# Altium schematic sheet Isolators.SchDoc
size A4; SheetNumber: 4; SheetTotal: 5
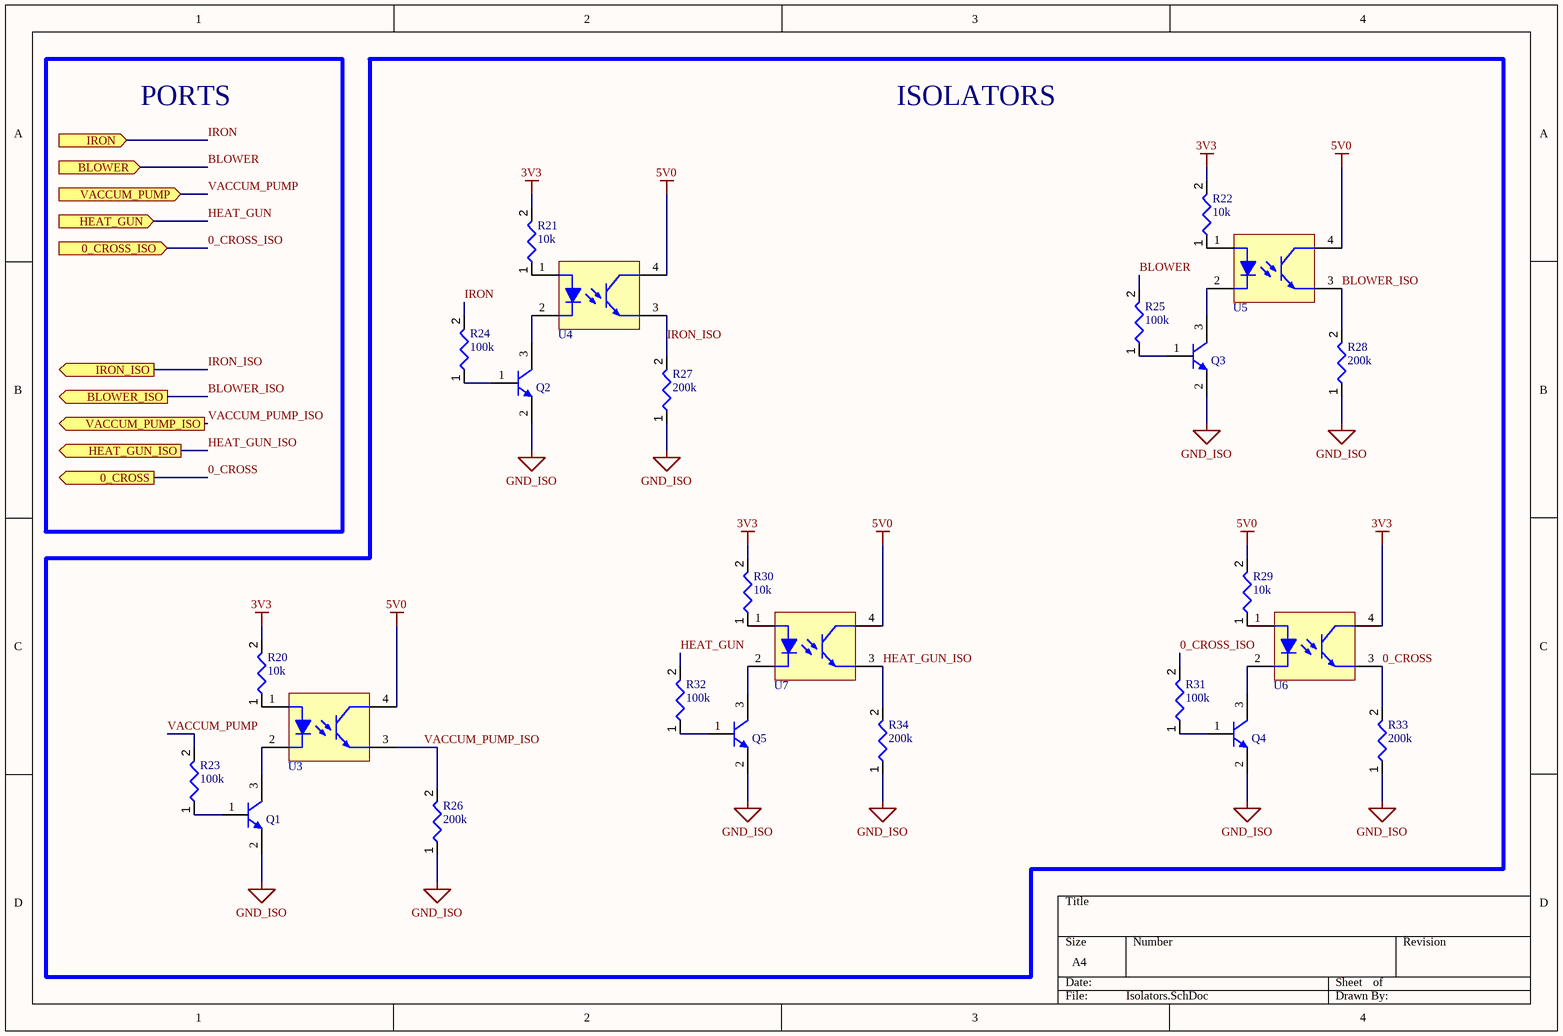
[diagram p0: Isolators.SchDoc]

## Parts
Q1  SMMBT2222ALT1G  [ONSC-SOT-23-3-318-08_V]  (value not drawn)
Q2  SMMBT2222ALT1G  [ONSC-SOT-23-3-318-08_V]  (value not drawn)
Q3  SMMBT2222ALT1G  [ONSC-SOT-23-3-318-08_V]  (value not drawn)
Q4  SMMBT2222ALT1G  [ONSC-SOT-23-3-318-08_V]  (value not drawn)
Q5  SMMBT2222ALT1G  [ONSC-SOT-23-3-318-08_V]  (value not drawn)
R20  value 10k  [Generic_0603_RES]  (hidden comment: RES-TK_SMD-0603_VIS-CRCW_K_10K_1/10W_1%)
R21  value 10k  [Generic_0603_RES]  (hidden comment: RES-TK_SMD-0603_VIS-CRCW_K_10K_1/10W_1%)
R22  value 10k  [Generic_0603_RES]  (hidden comment: RES-TK_SMD-0603_VIS-CRCW_K_10K_1/10W_1%)
R23  value 100k  [Generic_0603_RES]  (hidden comment: RES-TK_SMD-0603_VIS-CRCW_K_100K_1/10W_1%)
R24  value 100k  [Generic_0603_RES]  (hidden comment: RES-TK_SMD-0603_VIS-CRCW_K_100K_1/10W_1%)
R25  value 100k  [Generic_0603_RES]  (hidden comment: RES-TK_SMD-0603_VIS-CRCW_K_100K_1/10W_1%)
R26  value 200k  [Generic_0603_RES]  (hidden comment: RES-TK_SMD-0603_VIS-CRCW_K_200K_1/10W_1%)
R27  value 200k  [Generic_0603_RES]  (hidden comment: RES-TK_SMD-0603_VIS-CRCW_K_200K_1/10W_1%)
R28  value 200k  [Generic_0603_RES]  (hidden comment: RES-TK_SMD-0603_VIS-CRCW_K_200K_1/10W_1%)
R29  value 10k  [Generic_0603_RES]  (hidden comment: RES-TK_SMD-0603_VIS-CRCW_K_10K_1/10W_1%)
R30  value 10k  [Generic_0603_RES]  (hidden comment: RES-TK_SMD-0603_VIS-CRCW_K_10K_1/10W_1%)
R31  value 100k  [Generic_0603_RES]  (hidden comment: RES-TK_SMD-0603_VIS-CRCW_K_100K_1/10W_1%)
R32  value 100k  [Generic_0603_RES]  (hidden comment: RES-TK_SMD-0603_VIS-CRCW_K_100K_1/10W_1%)
R33  value 200k  [Generic_0603_RES]  (hidden comment: RES-TK_SMD-0603_VIS-CRCW_K_200K_1/10W_1%)
R34  value 200k  [Generic_0603_RES]  (hidden comment: RES-TK_SMD-0603_VIS-CRCW_K_200K_1/10W_1%)
U3  H11A817ASD  [FAIR-H11A817ASD-4_V]  (value not drawn)
U4  H11A817ASD  [FAIR-H11A817ASD-4_V]  (value not drawn)
U5  H11A817ASD  [FAIR-H11A817ASD-4_V]  (value not drawn)
U6  H11A817ASD  [FAIR-H11A817ASD-4_V]  (value not drawn)
U7  H11A817ASD  [FAIR-H11A817ASD-4_V]  (value not drawn)

## Blocks framed on the sheet
ISOLATORS: Q1-Q5 R20-R34 U3-U7

## Ports
0_CROSS (out, see 1[6B], 2[1D]), 0_CROSS_ISO (in, see 1[7B]), BLOWER (in, see 1[6B], 2[1D]), BLOWER_ISO (out, see 1[7B]), HEAT_GUN (in, see 1[6B], 2[1D]), HEAT_GUN_ISO (out, see 1[7B]), IRON (in, see 1[6B], 2[1C]), IRON_ISO (out, see 1[7B]), VACCUM_PUMP (in, see 1[6B], 2[1D]), VACCUM_PUMP_ISO (out, see 1[7B])

## Nets
3V3: R20.2 R21.2 R22.2 R30.2 U6.4(COLLECTOR)
5V0: R29.2 U3.4(COLLECTOR) U4.4(COLLECTOR) U5.4(COLLECTOR) U7.4(COLLECTOR)
GND_ISO: Q1.2(E) Q2.2(E) Q3.2(E) Q4.2(E) Q5.2(E) R26.1 R27.1 R28.1 R33.1 R34.1
0_CROSS: R33.2 U6.3(EMITTER) ; port 0_CROSS
0_CROSS_ISO: R31.2 ; port 0_CROSS_ISO
BLOWER: R25.2 ; port BLOWER
BLOWER_ISO: R28.2 U5.3(EMITTER) ; port BLOWER_ISO
HEAT_GUN: R32.2 ; port HEAT_GUN
HEAT_GUN_ISO: R34.2 U7.3(EMITTER) ; port HEAT_GUN_ISO
IRON: R24.2 ; port IRON
IRON_ISO: R27.2 U4.3(EMITTER) ; port IRON_ISO
VACCUM_PUMP: R23.2 ; port VACCUM_PUMP
VACCUM_PUMP_ISO: R26.2 U3.3(EMITTER) ; port VACCUM_PUMP_ISO
NetQ1_1: Q1.1(B) R23.1
NetQ1_3: Q1.3(C) U3.2(CATHODE)
NetQ2_1: Q2.1(B) R24.1
NetQ2_3: Q2.3(C) U4.2(CATHODE)
NetQ3_1: Q3.1(B) R25.1
NetQ3_3: Q3.3(C) U5.2(CATHODE)
NetQ4_1: Q4.1(B) R31.1
NetQ4_3: Q4.3(C) U6.2(CATHODE)
NetQ5_1: Q5.1(B) R32.1
NetQ5_3: Q5.3(C) U7.2(CATHODE)
NetR20_1: R20.1 U3.1(ANODE)
NetR21_1: R21.1 U4.1(ANODE)
NetR22_1: R22.1 U5.1(ANODE)
NetR29_1: R29.1 U6.1(ANODE)
NetR30_1: R30.1 U7.1(ANODE)

## Notes on the sheet
- PORTS

## Library data of the parts
Q1-Q5 = CMP-1048-00591-1: General Purpose Transistor, NPN Silicon, 3-Pin SOT-23, Pb-Free, Tape and Reel; Manufacturer: On Semiconductor; fT Min (MHz): 300; IC Continuous (A): 0.6; Mounting Technology: Surface Mount; ComponentLink1URL: http://www.onsemi.com/; Polarity: NPN; PackageDescription: 3-Pin Small Outline Transistor, Body 2.92 x 1.3 mm, Pitch 0.95 mm; RoHS: TRUE; DatasheetVersion: Rev. 10; Packing: Tape and Reel; PackageVersion: Rev. AP, 11/2009; ComponentLink3Description: Package Specification; PartNumber: SMMBT2222ALT1G; ComponentLink1Description: Manufacturer URL; ComponentLink3URL: http://www.onsemi.cn/pub_link/Collateral/318-08.PDF; PackageReference: SOT-23-3-318-08; ComponentLink2Description: Datasheet; ComponentLink2URL: http://www.onsemi.cn/pub_link/Collateral/MMBT2222LT1-D.PDF
R20-R22 R29 R30 = CMP-009-00231-2: Fixed Resistor, Metal Glaze/thick Film, 0.1W, 10000ohm, 75V, 1% +/-Tol, 100ppm/Cel, Surface Mount, 0603; Power: 100mW; Min Operating Temperature: -55°C; Case/Package: 0603; Max Operating Temperature: 155°C; RoHS Compliant: Yes; Voltage Rating: 75V; Tolerance: 1%; Pins: 2; Mounting Technology: Surface Mount
R23-R25 R31 R32 = CMP-009-00230-4: Fixed Resistor, Metal Glaze/thick Film, 0.1W, 100000ohm, 75V, 1% +/-Tol, 100ppm/Cel, Surface Mount, 0603; Power: 100mW; Pins: 2; Max Operating Temperature: 155°C; Mounting Technology: Surface Mount; Case/Package: 0603; RoHS Compliant: Yes; Voltage Rating: 75V; Tolerance: 1%; Min Operating Temperature: -55°C
R26-R28 R33 R34 = CMP-009-00209-5: Fixed Resistor, Metal Glaze/thick Film, 0.1W, 200000ohm, 75V, 1% +/-Tol, 100ppm/Cel, Surface Mount, 0603; Power: 100mW; RoHS Compliant: Yes; Voltage Rating: 75V; Tolerance: 1%; Case/Package: 0603; Min Operating Temperature: -55°C; Max Operating Temperature: 155°C; Mounting Technology: Surface Mount; Pins: 2
U3-U7 = CMP-001-0167-1: OptoCouplers & OptoIsolators Optocoupler SM-DIP4 Phototransistor; Power Dissipation: 200mW; Number of Circuits: 1; Output Current per Channel: 50mA; Fall Time: 18µs; Forward Voltage: 1.5V; Dark Current: 100nA; Isolation Voltage: 5kV; Collector Emitter Breakdown Voltage: 70V; Reverse Breakdown Voltage: 6V; Current Transfer Ratio: 80%; Collector Emitter Saturation Voltage: 200mV; Min Operating Temperature: -55°C; Case/Package: SMD/SMT; RoHS: Compliant; Forward Current: 50mA; Lifecycle Status: Obsolete; Max Power Dissipation: 200mW; Continuous Collector Current: 50mA; Pins: 4; Lead Free: Lead Free; Number of Channels: 1; Rise Time: 18µs; Max Operating Temperature: 100°C; Collector Emitter Voltage (VCEO): 70V; Output Voltage: 70V; Max Collector Current: 50mA; Packaging: Tape and Reel; Number of Elements: 1